# Altium schematic sheet amplificadorAudio.SchDoc: CONTROLADORA AIRPOPCORN
size A3; DocumentNumber: 10.00.0025; SheetNumber: 2; SheetTotal: 16
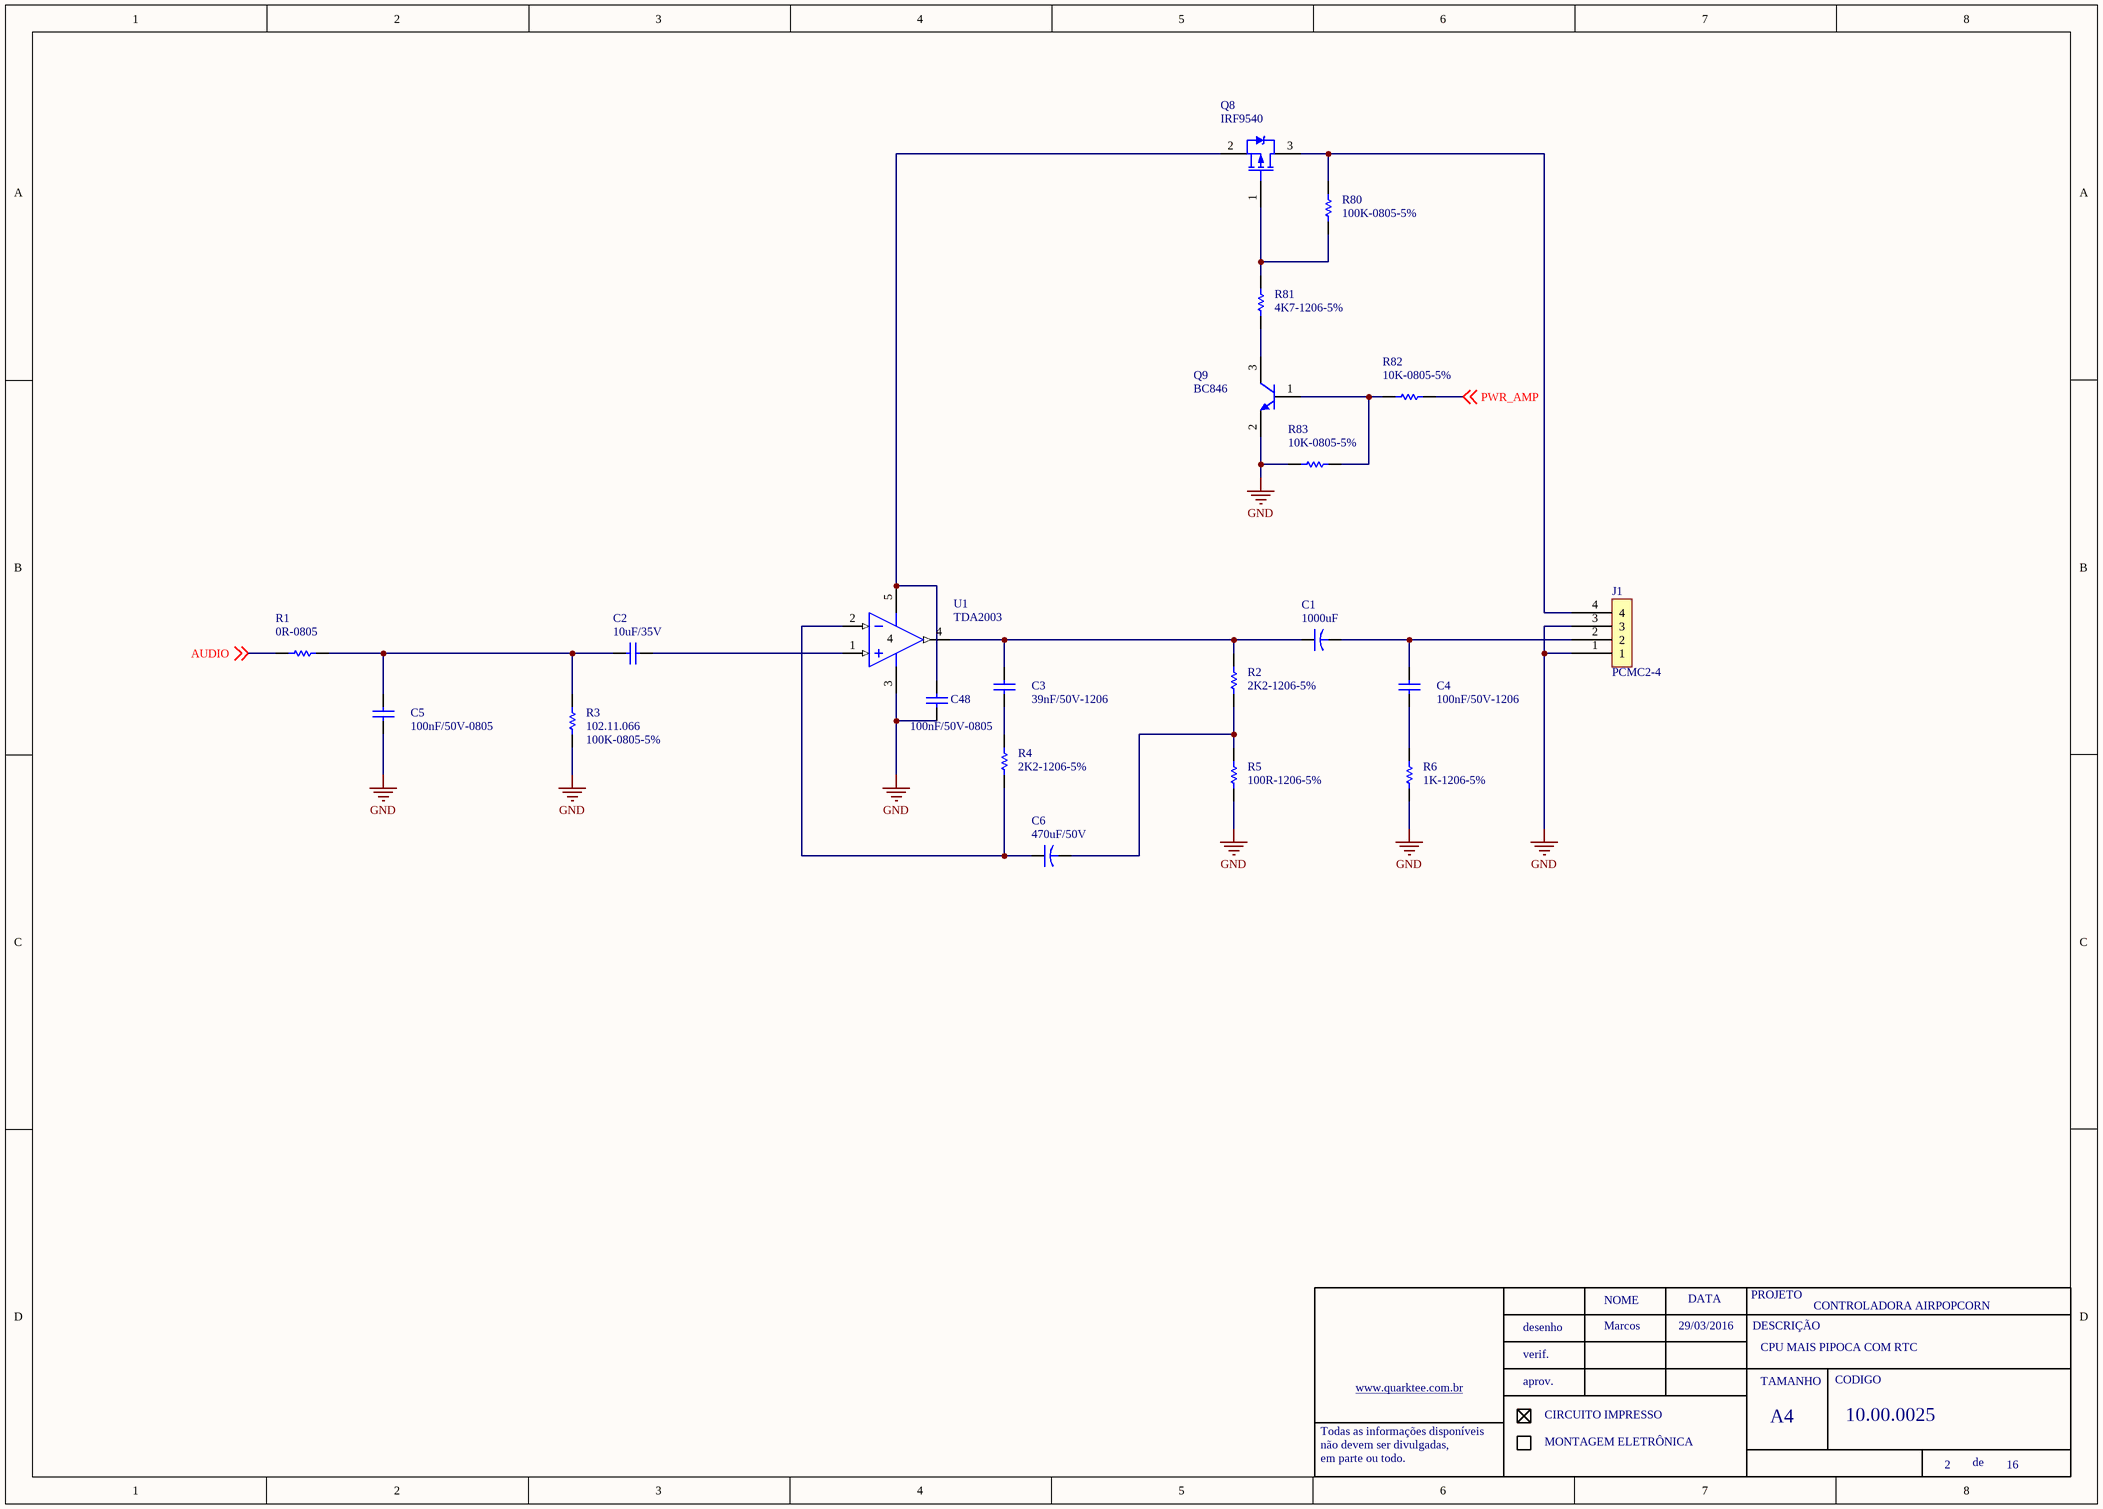
[diagram p0: amplificadorAudio.SchDoc]

## Parts
C1  1000uF  [CAP 10X5]
C2  10uF/35V  [CAP POL 5x11mm]
C3  39nF/50V-1206  [1206-REVISADO O]
C4  100nF/50V-1206  [1206-REVISADO O]
C5  100nF/50V-0805  [0805-REVISADO O]
C6  470uF/50V  [CAP 10X5]
C48  100nF/50V-0805  [0805-REVISADO O]
J1  PCMC2-4  [PCMC2-4]
Q8  IRF9540  [TO220-3 EM PÉ]
Q9  BC846  [SOT23 - REVISAD]
R1  0R-0805  [0805-REVISADO O]
R2  2K2-1206-5%  [1206-REVISADO O]
R3  100K-0805-5%  ERP: 102.11.066  [0805-REVISADO O]
R4  2K2-1206-5%  [1206-REVISADO O]
R5  100R-1206-5%  [1206-REVISADO O]
R6  1K-1206-5%  [1206-REVISADO O]
R80  100K-0805-5%  [0805-REVISADO O]
R81  4K7-1206-5%  [1206-REVISADO O]
R82  10K-0805-5%  [0805-REVISADO O]
R83  10K-0805-5%  [0805-REVISADO O]
U1  TDA2003  [PENTAWATT V]

## Nets
GND: C5.1 C48.1 J1.1 J1.3 Q9.2(E) R3.1 R5.2 R6.2 R83.1 U1.3(GND)
AUDIO: R1.1 ; off-sheet AUDIO
PWR_AMP: R82.2 ; off-sheet PWR_AMP
NetC1_1: C1.1 C3.2 R2.1 U1.4(OUT)
NetC1_2: C1.2 C4.2 J1.2
NetC2_1: C2.1 C5.2 R1.2 R3.2
NetC2_2: C2.2 U1.1(IN+)
NetC3_1: C3.1 R4.1
NetC4_1: C4.1 R6.1
NetC6_1: C6.1 R4.2 U1.2(IN-)
NetC6_2: C6.2 R2.2 R5.1
NetC48_2: C48.2 Q8.2(DRENO) U1.5(V+)
NetJ1_4: J1.4 Q8.3(SOURCE) R80.2
NetQ8_1: Q8.1(GATE) R80.1 R81.2
NetQ9_1: Q9.1(B) R82.1 R83.2
NetQ9_3: Q9.3(C) R81.1

## Notes on the sheet
- Marcos
- 29/03/2016
- CPU MAIS PIPOCA COM RTC
- NOME
- DATA
- PROJETO
- DESCRIÇÃO
- www.quarktee.com.br
- desenho
- verif.
- aprov.
- TAMANHO
- CODIGO
- Todas as informações disponíveis
- não devem ser divulgadas,
- em parte ou todo.
- CIRCUITO IMPRESSO
- MONTAGEM ELETRÔNICA
- A4
- de

## Library data of the parts
C1 = 470uF/50V: ERP: 105.01.005
C2 = 10uF/35V-tantalo-2413
C3-C5 C48 = 100nF/50-0805-NPO: ERP: 104.11.005
Q9 = BC846: BC846L; ERP: 106.22.001
R1 = 1K-0805-5%: ERP: 102.11.042
R2 R4-R6 = 390R-2512-5%: ERP: 102.31.002
R80 = RES 100K-0805: 100K-0805; ERP: 102.11.066
C6 = 470uF/50V: ERP: 105.01.005
R81 = 4K7-1206-5%: ERP: 102.12.050
R82 R83 = 10K-0805-5%: ERP: 102.11.054